# Altium project Arduino - FPGA Development Board.PrjPcb (part 2 of 2)

## Sheet Power - 1V2.SchDoc
size A4
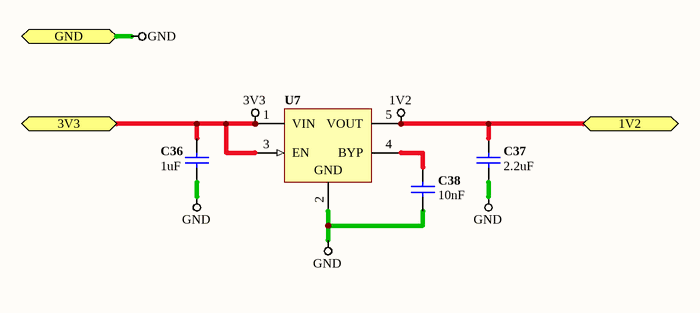
[diagram p10: Power - 1V2.SchDoc]

### Parts
C36  value 1uF  [CAPC0402(1005)60_L]  (hidden comment: CAP 1uF 16V 0402(1005))
C37  value 2.2uF  [CAPC0603(1608)55_L]  (hidden comment: CAP 2.2uF 16V 0603(1608))
C38  value 10nF  [CAPC0402(1005)33_L]  (hidden comment: CAP 10nF 16V 0402(1005))
U7  CAT6219-125TDGT3  [ONSC-SOT23-5_M]  (value not drawn)

### Ports
1V2, 3V3, GND

### Nets
1V2: C37.2 U7.5(VOUT) ; port 1V2
3V3: C36.2 U7.1(VIN) U7.3(EN) ; port 3V3
GND: C36.1 C37.1 C38.1 U7.2(GND) ; port GND
NetC38_2: C38.2 U7.4(BYP)

### Library data of the parts
C36 = CMP-1034-02119-1: CAP 1uF 16V ±10% 0402 (1005 Metric) Thickness 0.6mm SMD; Manufacturer_PN: C1005X5R1C105K050BC; Case-EIA: 0402; Case-Metric: 1005; Technology: SMT; Rated Voltage: 16 V; Tolerance: ±10%; Max Thickness: 0.6 mm; Manufacturer Part Number: C1005X5R1C105K050BC
C37 = CMP-1035-02762-1: CAP 2.2uF 16V ±10% 0603 (1608 Metric) Thickness 0.55mm SMD; Manufacturer_PN: C0603C225K4PACTU; Case-EIA: 0603; Case-Metric: 1608; Max Thickness: 0.55 mm; Technology: SMT; Rated Voltage: 16 V; Tolerance: ±10%; Manufacturer Part Number: C0603C225K4PACTU
C38 = CMP-1034-01875-1: CAP 10nF 16V ±10% 0402 (1005 Metric) Thickness 0.33mm SMD; Manufacturer_PN: GRM155R61C103KA01D; Case-EIA: 0402; Case-Metric: 1005; Max Thickness: 0.33 mm; Tolerance: ±10%; Rated Voltage: 16 V; Technology: SMT; Manufacturer Part Number: GRM155R61C103KA01D
U7 = CAT6219-125TDGT3: Fixed Low Drop Positive Voltage Regulator, 1.2V 5-Pin TSOT-23, Tape and Reel; PartNumber: CAT6219-330TDGT3; Manufacturer: ON Semiconductor; Io Typ(A): 0.5; VDO Typ (V): 0.3; Noise (ÂµVrms): 45; Vo(V): 1.25; Iq Typ (mA): 0.085; PSRR (dB): 64; Output: Single; VI Max (V): 5.5; Mounting Technology: Surface Mount; ComponentLink1URL: http://www.onsemi.com/; DatasheetVersion: Rev. 14; ComponentLink1Description: Manufacturer URL; ComponentLink3URL: http://www.onsemi.com/pub_link/Collateral/419AE.PDF; PackageVersion: Rev. O; PackageDescription: 5-Pin Plastic Small Outline Package, Body 2.9 x 1.6mm, Pitch 0.95mm; Polarity: Positive; Rohs: Pb-free; PackageReference: TSOT-23; ComponentLink3Description: Package Specification; ComponentLink2URL: http://www.onsemi.com/pub_link/Collateral/CAT6219-D.PDF; ComponentLink2Description: Datasheet; Package Type: TSOT-23-5; Manufacturer_PN: CAT6219-330TDGT3; Manufacturer Part Number: CAT6219-330TDGT3

## Sheet LEDS - Status.SchDoc
size A4
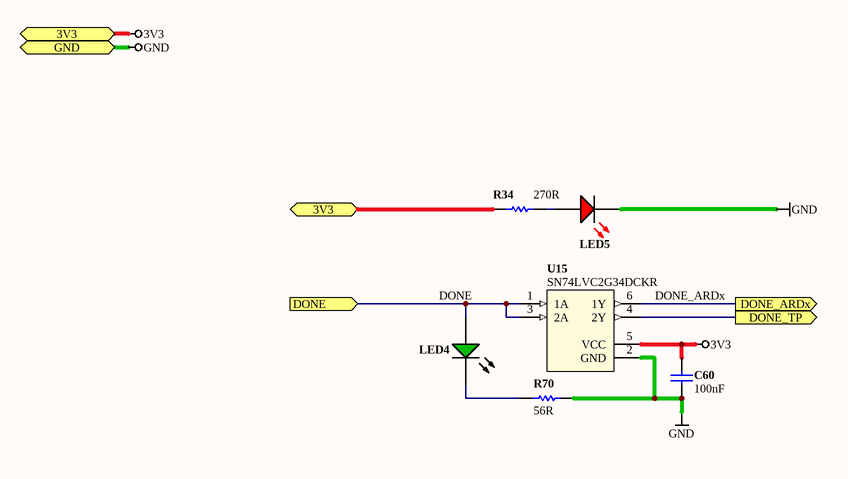
[diagram p11: LEDS - Status.SchDoc]

### Parts
C60  value 100nF  [CAPC0402(1005)60_L]  (hidden comment: CAP 100nF 10V 0402(1005))
LED4  LED_GREEN_APT1608SGC  [LED0603]  (value not drawn)
LED5  0402-LED-RED  [LED_0402]  (value not drawn)
R34  value 270R  [RESC0402(1005)40_L]  (hidden comment: 270R 1 0402)
R70  value 56R  [RESC0402(1005)_L]  (hidden comment: 56R 1% 0402(1005))
U15  SN74LVC2G34DCKR  [TI-DCK6_L]

### Ports
3V3, DONE (in), DONE_ARDx (out), DONE_TP (out), GND

### Nets
3V3: C60.2 R34.1 U15.5(VCC) ; port 3V3
GND: C60.1 LED5.2(K) R70.2 U15.2(GND) ; port GND
DONE: LED4.1(A) U15.1(1A) U15.3(2A) ; port DONE
DONE_ARDx: U15.6(1Y) ; port DONE_ARDx
DONE_TP: U15.4(2Y) ; port DONE_TP
NetLED4_2: LED4.2(K) R70.1
NetLED5_1: LED5.1(A) R34.2

### Library data of the parts
C60 = CMP-1034-02064-1: CAP 100nF 10V ±5% 0402 (1005 Metric) Thickness 0.6mm SMD; Manufacturer_PN: C0402C104K8PACTU; Case-EIA: 0402; Case-Metric: 1005; Max Thickness: 0.6 mm; Tolerance: ±5%; Rated Voltage: 10 V; Technology: SMT; Manufacturer Part Number: C0402C104K8PACTU
LED4 = LED_GREEN_APT1608SGC: SMD 0603 LED, GREEN; DefaultDesignator: LED?; Class: Diodes; Forward Voltage (Vf): 2.2V; PartNumber: APT1608SGC; Sub Class: LED; Color: Green; Manufacturer_PN: APT1608SGC; Manufacturer Part Number: APT1608SGC
LED5 = CMP-0201-0013: 0402 LED,RED; Manufacturer_PN: LTST-C190KRKT; DefaultDesignator: LED?; Class: Diodes; Current Average (Io): 1.8V; ID: CMP-0201-0013; Sub Class: LED; Reverse Voltage DC (Vr): Red; ComponentLink1Description: Datasheet; ComponentLink1URL: http://optoelectronics.liteon.com/upload/download/DS-22-99-0151/S_110_LTST-C190KRKT.pdf; ComponentLink2Description: Manufacturer; ComponentLink2URL: www.liteon.com; Manufacturer Part Number: LTST-C190KRKT
R34 = CMP-0503-0059: 0402 (1005 Metric) 1/16 W 270R 1 Thick Film Chip Resistor; Manufacturer_PN: RC1005F271CS; Case-EIA: 0402; Case-Metric: 1005; Temp Coefficient ppm/°C: ±100; Tolerance %: 1%; Value (Ohms): 270; Power: 1/16 W; ID: CMP-0503-0059; Technology: SMT; Manufacturer Part Number: RC1005F271CS
R70 = CMP-1011-00369-1: 56R 0.063W 1% 0402 (1005 Metric)  SMD; Manufacturer_PN: RC0402FR-0756RL; Case-Metric: 1005; Case-EIA: 0402; Power: 0.063 W; Tolerance: 1 %; Technology: SMT; Manufacturer Part Number: RC0402FR-0756RL
U15 = SN74LVC2G34DCKR: IC BUFFER DUAL NON-INV SC706; Manufacturer: Texas Instruments; DefaultDesignator: U?; Class: Logic; Sub Class: Buffer-Line Driver; Description2: IC BUFF/DVR TRI-ST OCTAL 20-VQFN; Logic Type: Buffer/Line Driver, Non-Inverting; Number of Elements: 2; Number of Bits per Element: 4; Current - Output High, Low: 24mA, 24mA; Voltage - Supply: 1.65 V ~ 3.6 V; PartNumber: SN74LVC2G34DCKR; ComponentLink1Description: Datasheet; ComponentLink1URL: http://www.ti.com/lit/ds/symlink/sn74lvc2g34.pdf; ComponentLink2Description: Manufacturer; ComponentLink2URL: www.ti.com; Series: 74LVC; Operating Temperature: -40°C ~ 125°C; Manufacturer_PN: SN74LVC2G34DCKR; Manufacturer Part Number: SN74LVC2G34DCKR

## Nets that join several sheets
1V2: FPGA - Decoupling (9 pins), Power - 1V2 (C37.2 U7.5)
3V3: Arduino FPGA Top-Level Interface (9 pins), Arduino FPGA Design (C101.1 R15.2 X2.4), Flash - S25FL216K0PMFI041 (C1.1 R7.2 R8.2 U2.8), FPGA - XC6SLX9-2TQG144C (10 pins), FPGA - Decoupling (36 pins), Arduino FPGA SPI MUX (C22.1 U3.16), SRAM0 - IS61WV12816DBLL-10BLI (6 pins), Power - 3V3 (C34.1 U6.2 U6.4), Power - 1V2 (C36.2 U7.1 U7.3), LEDS - Status (C60.2 R34.1 U15.5)
5V0: Arduino FPGA Top-Level Interface (PWR6.1 PWR6.2), Arduino FPGA Level Translation (C35.2 C39.2 U8.24 U9.24), Power - 5V0 (J12.2), Power - 3V3 (C33.1 U6.3)
5V0_ARD: Arduino FPGA Top-Level Interface (J7.5), Power - 5V0 (J12.3)
GND: Arduino FPGA Top-Level Interface (17 pins), Arduino FPGA Design (C101.2 R14.1 SW1.2 X2.2), Flash - S25FL216K0PMFI041 (C1.2 U2.4), FPGA - XC6SLX9-2TQG144C (R3.1 R4.1 U1#1.73), FPGA - Decoupling (37 pins), Arduino FPGA SPI MUX (C22.2 U3.8 U3.15), SRAM0 - IS61WV12816DBLL-10BLI (6 pins), Arduino FPGA Level Translation (8 pins), Power - 5V0 (5 pins), Power - 3V3 (C33.2 C34.2 U6.1), Power - 1V2 (C36.1 C37.1 C38.1 U7.2), LEDS - Status (C60.1 LED5.2 R70.2 U15.2)
ALT_DONEx: FPGA - XC6SLX9-2TQG144C (U1#2.59), Arduino FPGA Level Translation (U8.23)
ARD_D0(RX): Arduino FPGA Top-Level Interface (J8.1), Arduino FPGA Level Translation (U8.11)
ARD_D0(RX)x: FPGA - XC6SLX9-2TQG144C (U1#2.55), Arduino FPGA Level Translation (U8.10)
ARD_D1(TX): Arduino FPGA Top-Level Interface (J8.2), Arduino FPGA Level Translation (U8.8)
ARD_D1(TX)x: FPGA - XC6SLX9-2TQG144C (U1#2.57), Arduino FPGA Level Translation (U8.9)
ARD_D4: Arduino FPGA Top-Level Interface (J8.5), Arduino FPGA Level Translation (U9.7)
ARD_D4x: FPGA - XC6SLX9-2TQG144C (U1#2.61), Arduino FPGA Level Translation (U9.6)
ARD_D5: Arduino FPGA Top-Level Interface (J8.6), Arduino FPGA Level Translation (U9.8)
ARD_D5x: FPGA - XC6SLX9-2TQG144C (U1#2.62), Arduino FPGA Level Translation (U9.9)
ARD_D6: Arduino FPGA Top-Level Interface (J8.7), Arduino FPGA Level Translation (U9.11)
ARD_D6x: FPGA - XC6SLX9-2TQG144C (U1#2.64), Arduino FPGA Level Translation (U9.10)
ARD_D7: Arduino FPGA Top-Level Interface (J8.8), Arduino FPGA Level Translation (J14.2 U8.18)
ARD_D8: Arduino FPGA Top-Level Interface (J9.1), Arduino FPGA Level Translation (U9.3)
ARD_D8x: FPGA - XC6SLX9-2TQG144C (U1#1.74), Arduino FPGA Level Translation (U9.2)
ARD_D11: Arduino FPGA Top-Level Interface (J9.4), Arduino FPGA Level Translation (U9.18)
ARD_D11x: FPGA - XC6SLX9-2TQG144C (U1#1.102), Arduino FPGA Level Translation (U9.19)
ARD_D12: Arduino FPGA Top-Level Interface (J9.5), Arduino FPGA Level Translation (U9.17)
ARD_D12x: FPGA - XC6SLX9-2TQG144C (U1#1.104), Arduino FPGA Level Translation (U9.16)
ARD_D13: Arduino FPGA Top-Level Interface (J9.6), Arduino FPGA Level Translation (U9.14)
ARD_D13x: FPGA - XC6SLX9-2TQG144C (U1#1.105), Arduino FPGA Level Translation (U9.15)
CCLK: FPGA - XC6SLX9-2TQG144C (R1.1 R3.2 U1#2.70), Arduino FPGA SPI MUX (U3.11)
CS_ARD_ALT_N: Arduino FPGA Top-Level Interface (J9.2), Arduino FPGA Level Translation (U9.22)
CS_ARD_ALT_Nx: FPGA - XC6SLX9-2TQG144C (U1#1.75), Arduino FPGA Level Translation (J13.3 U9.23)
CS_ARD_N: FPGA - XC6SLX9-2TQG144C (U1#2.48), Arduino FPGA SPI MUX (U3.13), Arduino FPGA Level Translation (J13.2)
CS_ARD_STD_N: Arduino FPGA Top-Level Interface (J9.3), Arduino FPGA Level Translation (U9.21)
CS_ARD_STD_Nx: FPGA - XC6SLX9-2TQG144C (U1#1.101), Arduino FPGA Level Translation (J13.1 U9.20)
CS_FL_N: Flash - S25FL216K0PMFI041 (U2.1), Arduino FPGA SPI MUX (U3.12)
CSO_B_FPGA: FPGA - XC6SLX9-2TQG144C (R6.1 U1#2.38), Arduino FPGA SPI MUX (U3.14)
DONE: FPGA - XC6SLX9-2TQG144C (R22.1 U1#1.71), LEDS - Status (LED4.1 U15.1 U15.3)
DONE_ARDx: Arduino FPGA Level Translation (U8.20), LEDS - Status (U15.6)
DONE_TP: Arduino FPGA Top-Level Interface (TP1.1), LEDS - Status (U15.4)
FPGA_CLK: Arduino FPGA Design (R13.1), FPGA - XC6SLX9-2TQG144C (U1#2.56)
HARD_TCK: Arduino FPGA Top-Level Interface (J5.1), FPGA - XC6SLX9-2TQG144C (R17.1 R24.1)
HARD_TDI: Arduino FPGA Top-Level Interface (J5.3), FPGA - XC6SLX9-2TQG144C (R18.1 R26.1)
HARD_TDO: Arduino FPGA Top-Level Interface (J5.5), FPGA - XC6SLX9-2TQG144C (R19.1 R27.1)
HARD_TMS: Arduino FPGA Top-Level Interface (J5.7), FPGA - XC6SLX9-2TQG144C (R20.1 R29.1)
HOLD_N: Arduino FPGA Top-Level Interface (TP3.1), Flash - S25FL216K0PMFI041 (R8.1 U2.7)
INIT_B: Arduino FPGA Top-Level Interface (TP4.1), FPGA - XC6SLX9-2TQG144C (R5.1 U1#2.39)
IO0: Arduino FPGA Top-Level Interface (J1.1 R16.2), FPGA - XC6SLX9-2TQG144C (U1#1.116)
IO1: Arduino FPGA Top-Level Interface (J2.1), FPGA - XC6SLX9-2TQG144C (U1#1.117)
IO2: Arduino FPGA Top-Level Interface (J3.1), FPGA - XC6SLX9-2TQG144C (U1#1.118)
IO3: Arduino FPGA Top-Level Interface (J4.1), FPGA - XC6SLX9-2TQG144C (U1#1.119)
IO4: Arduino FPGA Top-Level Interface (J1.2 R23.2), FPGA - XC6SLX9-2TQG144C (U1#1.120)
IO5: Arduino FPGA Top-Level Interface (J2.2), FPGA - XC6SLX9-2TQG144C (U1#1.121)
IO6: Arduino FPGA Top-Level Interface (J3.2), FPGA - XC6SLX9-2TQG144C (U1#1.123)
IO7: Arduino FPGA Top-Level Interface (J4.2), FPGA - XC6SLX9-2TQG144C (U1#1.124)
IO8: Arduino FPGA Top-Level Interface (J1.3 R25.2), FPGA - XC6SLX9-2TQG144C (U1#1.126)
IO9: Arduino FPGA Top-Level Interface (J2.3), FPGA - XC6SLX9-2TQG144C (U1#1.127)
IO10: Arduino FPGA Top-Level Interface (J3.3), FPGA - XC6SLX9-2TQG144C (U1#1.132)
IO11: Arduino FPGA Top-Level Interface (J4.3), FPGA - XC6SLX9-2TQG144C (U1#1.133)
IO12: Arduino FPGA Top-Level Interface (J1.4 R28.2), FPGA - XC6SLX9-2TQG144C (U1#1.134)
IO13: Arduino FPGA Top-Level Interface (J2.4), FPGA - XC6SLX9-2TQG144C (U1#1.137)
IO14: Arduino FPGA Top-Level Interface (J3.4), FPGA - XC6SLX9-2TQG144C (U1#1.138)
IO15: Arduino FPGA Top-Level Interface (J4.4), FPGA - XC6SLX9-2TQG144C (U1#1.139)
IO16: Arduino FPGA Top-Level Interface (J1.5), FPGA - XC6SLX9-2TQG144C (U1#1.140)
IO17: Arduino FPGA Top-Level Interface (J2.5), FPGA - XC6SLX9-2TQG144C (U1#1.141)
IO18: Arduino FPGA Top-Level Interface (J3.5), FPGA - XC6SLX9-2TQG144C (U1#1.142)
IO19: Arduino FPGA Top-Level Interface (J4.5), FPGA - XC6SLX9-2TQG144C (U1#1.143)
IO20: Arduino FPGA Top-Level Interface (J1.6), FPGA - XC6SLX9-2TQG144C (U1#1.144)
IO21: Arduino FPGA Top-Level Interface (J2.6), FPGA - XC6SLX9-2TQG144C (U1#1.1)
IO22: Arduino FPGA Top-Level Interface (J3.6), FPGA - XC6SLX9-2TQG144C (U1#1.2)
IO23: Arduino FPGA Top-Level Interface (J4.6), FPGA - XC6SLX9-2TQG144C (U1#1.5)
MISO_ARD: Arduino FPGA Top-Level Interface (J10.1), Arduino FPGA Level Translation (U8.4)
MISO_ARDx: Arduino FPGA SPI MUX (U3.3), Arduino FPGA Level Translation (U8.5)
MISO_FL: Flash - S25FL216K0PMFI041 (U2.2), Arduino FPGA SPI MUX (U3.4)
MISO_FPGA: FPGA - XC6SLX9-2TQG144C (U1#2.65), Arduino FPGA SPI MUX (U3.2)
MOSI_ARD: Arduino FPGA Top-Level Interface (J10.4), Arduino FPGA Level Translation (U8.3)
MOSI_ARDx: Arduino FPGA SPI MUX (U3.6), Arduino FPGA Level Translation (U8.2)
MOSI_FL: Flash - S25FL216K0PMFI041 (U2.5), Arduino FPGA SPI MUX (U3.7)
MOSI_FPGA: FPGA - XC6SLX9-2TQG144C (U1#2.66), Arduino FPGA SPI MUX (U3.5)
MUX_SEL: Arduino FPGA Top-Level Interface (J8.3), Arduino FPGA Level Translation (U8.14)
MUX_SELx: Arduino FPGA Design (R14.2), FPGA - XC6SLX9-2TQG144C (U1#2.58), Arduino FPGA SPI MUX (U3.1), Arduino FPGA Level Translation (U8.15)
PROGRAM_B: Arduino FPGA Top-Level Interface (J8.4), Arduino FPGA Level Translation (U8.17)
PROGRAM_Bx: FPGA - XC6SLX9-2TQG144C (R21.1 U1#1.37), Arduino FPGA Level Translation (U8.16)
RESET_N: Arduino FPGA Design (R15.1 SW1.1), FPGA - XC6SLX9-2TQG144C (U1#1.131)
SCLK_ARD: Arduino FPGA Top-Level Interface (J10.3), Arduino FPGA Level Translation (U8.7)
SCLK_ARDx: Arduino FPGA SPI MUX (U3.10), Arduino FPGA Level Translation (U8.6)
SCLK_FL: Flash - S25FL216K0PMFI041 (U2.6), Arduino FPGA SPI MUX (U3.9)
SOFT_TCK: Arduino FPGA Top-Level Interface (J5.4), FPGA - XC6SLX9-2TQG144C (R10.1)
SOFT_TDI: Arduino FPGA Top-Level Interface (J5.6), FPGA - XC6SLX9-2TQG144C (R11.1)
SOFT_TDO: Arduino FPGA Top-Level Interface (J5.8), FPGA - XC6SLX9-2TQG144C (R12.1)
SOFT_TMS: Arduino FPGA Top-Level Interface (J5.2), FPGA - XC6SLX9-2TQG144C (R9.1)
SRAM0_A0: FPGA - XC6SLX9-2TQG144C (U1#1.16), SRAM0 - IS61WV12816DBLL-10BLI (U5.A3)
SRAM0_A1: FPGA - XC6SLX9-2TQG144C (U1#1.21), SRAM0 - IS61WV12816DBLL-10BLI (U5.A4)
SRAM0_A2: FPGA - XC6SLX9-2TQG144C (U1#1.24), SRAM0 - IS61WV12816DBLL-10BLI (U5.A5)
SRAM0_A3: FPGA - XC6SLX9-2TQG144C (U1#1.17), SRAM0 - IS61WV12816DBLL-10BLI (U5.B3)
SRAM0_A4: FPGA - XC6SLX9-2TQG144C (U1#1.23), SRAM0 - IS61WV12816DBLL-10BLI (U5.B4)
SRAM0_A5: FPGA - XC6SLX9-2TQG144C (U1#1.15), SRAM0 - IS61WV12816DBLL-10BLI (U5.C3)
SRAM0_A6: FPGA - XC6SLX9-2TQG144C (U1#1.22), SRAM0 - IS61WV12816DBLL-10BLI (U5.C4)
SRAM0_A7: FPGA - XC6SLX9-2TQG144C (U1#1.33), SRAM0 - IS61WV12816DBLL-10BLI (U5.D4)
SRAM0_A8: FPGA - XC6SLX9-2TQG144C (U1#1.95), SRAM0 - IS61WV12816DBLL-10BLI (U5.H2)
SRAM0_A9: FPGA - XC6SLX9-2TQG144C (U1#1.93), SRAM0 - IS61WV12816DBLL-10BLI (U5.H3)
SRAM0_A10: FPGA - XC6SLX9-2TQG144C (U1#1.88), SRAM0 - IS61WV12816DBLL-10BLI (U5.H4)
SRAM0_A11: FPGA - XC6SLX9-2TQG144C (U1#1.84), SRAM0 - IS61WV12816DBLL-10BLI (U5.H5)
SRAM0_A12: FPGA - XC6SLX9-2TQG144C (U1#1.92), SRAM0 - IS61WV12816DBLL-10BLI (U5.G3)
SRAM0_A13: FPGA - XC6SLX9-2TQG144C (U1#1.87), SRAM0 - IS61WV12816DBLL-10BLI (U5.G4)
SRAM0_A14: FPGA - XC6SLX9-2TQG144C (U1#1.94), SRAM0 - IS61WV12816DBLL-10BLI (U5.F3)
SRAM0_A15: FPGA - XC6SLX9-2TQG144C (U1#1.85), SRAM0 - IS61WV12816DBLL-10BLI (U5.F4)
SRAM0_A16: FPGA - XC6SLX9-2TQG144C (U1#1.78), SRAM0 - IS61WV12816DBLL-10BLI (U5.E4)
SRAM0_A17: FPGA - XC6SLX9-2TQG144C (U1#1.6), SRAM0 - IS61WV12816DBLL-10BLI (U5.D3)
SRAM0_CS_N: FPGA - XC6SLX9-2TQG144C (U1#1.26), SRAM0 - IS61WV12816DBLL-10BLI (U5.B5)
SRAM0_D0: FPGA - XC6SLX9-2TQG144C (U1#1.27), SRAM0 - IS61WV12816DBLL-10BLI (U5.B6)
SRAM0_D1: FPGA - XC6SLX9-2TQG144C (U1#1.29), SRAM0 - IS61WV12816DBLL-10BLI (U5.C5)
SRAM0_D2: FPGA - XC6SLX9-2TQG144C (U1#1.30), SRAM0 - IS61WV12816DBLL-10BLI (U5.C6)
SRAM0_D3: FPGA - XC6SLX9-2TQG144C (U1#1.32), SRAM0 - IS61WV12816DBLL-10BLI (U5.D5)
SRAM0_D4: FPGA - XC6SLX9-2TQG144C (U1#1.79), SRAM0 - IS61WV12816DBLL-10BLI (U5.E5)
SRAM0_D5: FPGA - XC6SLX9-2TQG144C (U1#1.81), SRAM0 - IS61WV12816DBLL-10BLI (U5.F5)
SRAM0_D6: FPGA - XC6SLX9-2TQG144C (U1#1.80), SRAM0 - IS61WV12816DBLL-10BLI (U5.F6)
SRAM0_D7: FPGA - XC6SLX9-2TQG144C (U1#1.82), SRAM0 - IS61WV12816DBLL-10BLI (U5.G6)
SRAM0_D8: FPGA - XC6SLX9-2TQG144C (U1#1.10), SRAM0 - IS61WV12816DBLL-10BLI (U5.B1)
SRAM0_D9: FPGA - XC6SLX9-2TQG144C (U1#1.8), SRAM0 - IS61WV12816DBLL-10BLI (U5.C1)
SRAM0_D10: FPGA - XC6SLX9-2TQG144C (U1#1.9), SRAM0 - IS61WV12816DBLL-10BLI (U5.C2)
SRAM0_D11: FPGA - XC6SLX9-2TQG144C (U1#1.7), SRAM0 - IS61WV12816DBLL-10BLI (U5.D2)
SRAM0_D12: FPGA - XC6SLX9-2TQG144C (U1#1.100), SRAM0 - IS61WV12816DBLL-10BLI (U5.E2)
SRAM0_D13: FPGA - XC6SLX9-2TQG144C (U1#1.98), SRAM0 - IS61WV12816DBLL-10BLI (U5.F2)
SRAM0_D14: FPGA - XC6SLX9-2TQG144C (U1#1.99), SRAM0 - IS61WV12816DBLL-10BLI (U5.F1)
SRAM0_D15: FPGA - XC6SLX9-2TQG144C (U1#1.97), SRAM0 - IS61WV12816DBLL-10BLI (U5.G1)
SRAM0_HBE_N: FPGA - XC6SLX9-2TQG144C (U1#1.12), SRAM0 - IS61WV12816DBLL-10BLI (U5.B2)
SRAM0_LBE_N: FPGA - XC6SLX9-2TQG144C (U1#1.11), SRAM0 - IS61WV12816DBLL-10BLI (U5.A1)
SRAM0_OE_N: FPGA - XC6SLX9-2TQG144C (U1#1.14), SRAM0 - IS61WV12816DBLL-10BLI (U5.A2)
SRAM0_WE_N: FPGA - XC6SLX9-2TQG144C (U1#1.83), SRAM0 - IS61WV12816DBLL-10BLI (U5.G5)
WP_N: Arduino FPGA Top-Level Interface (TP2.1), Flash - S25FL216K0PMFI041 (R7.1 U2.3)